# EAGLE design Interface (EAGLE 7.6.0)

## Sheet 1 of 2
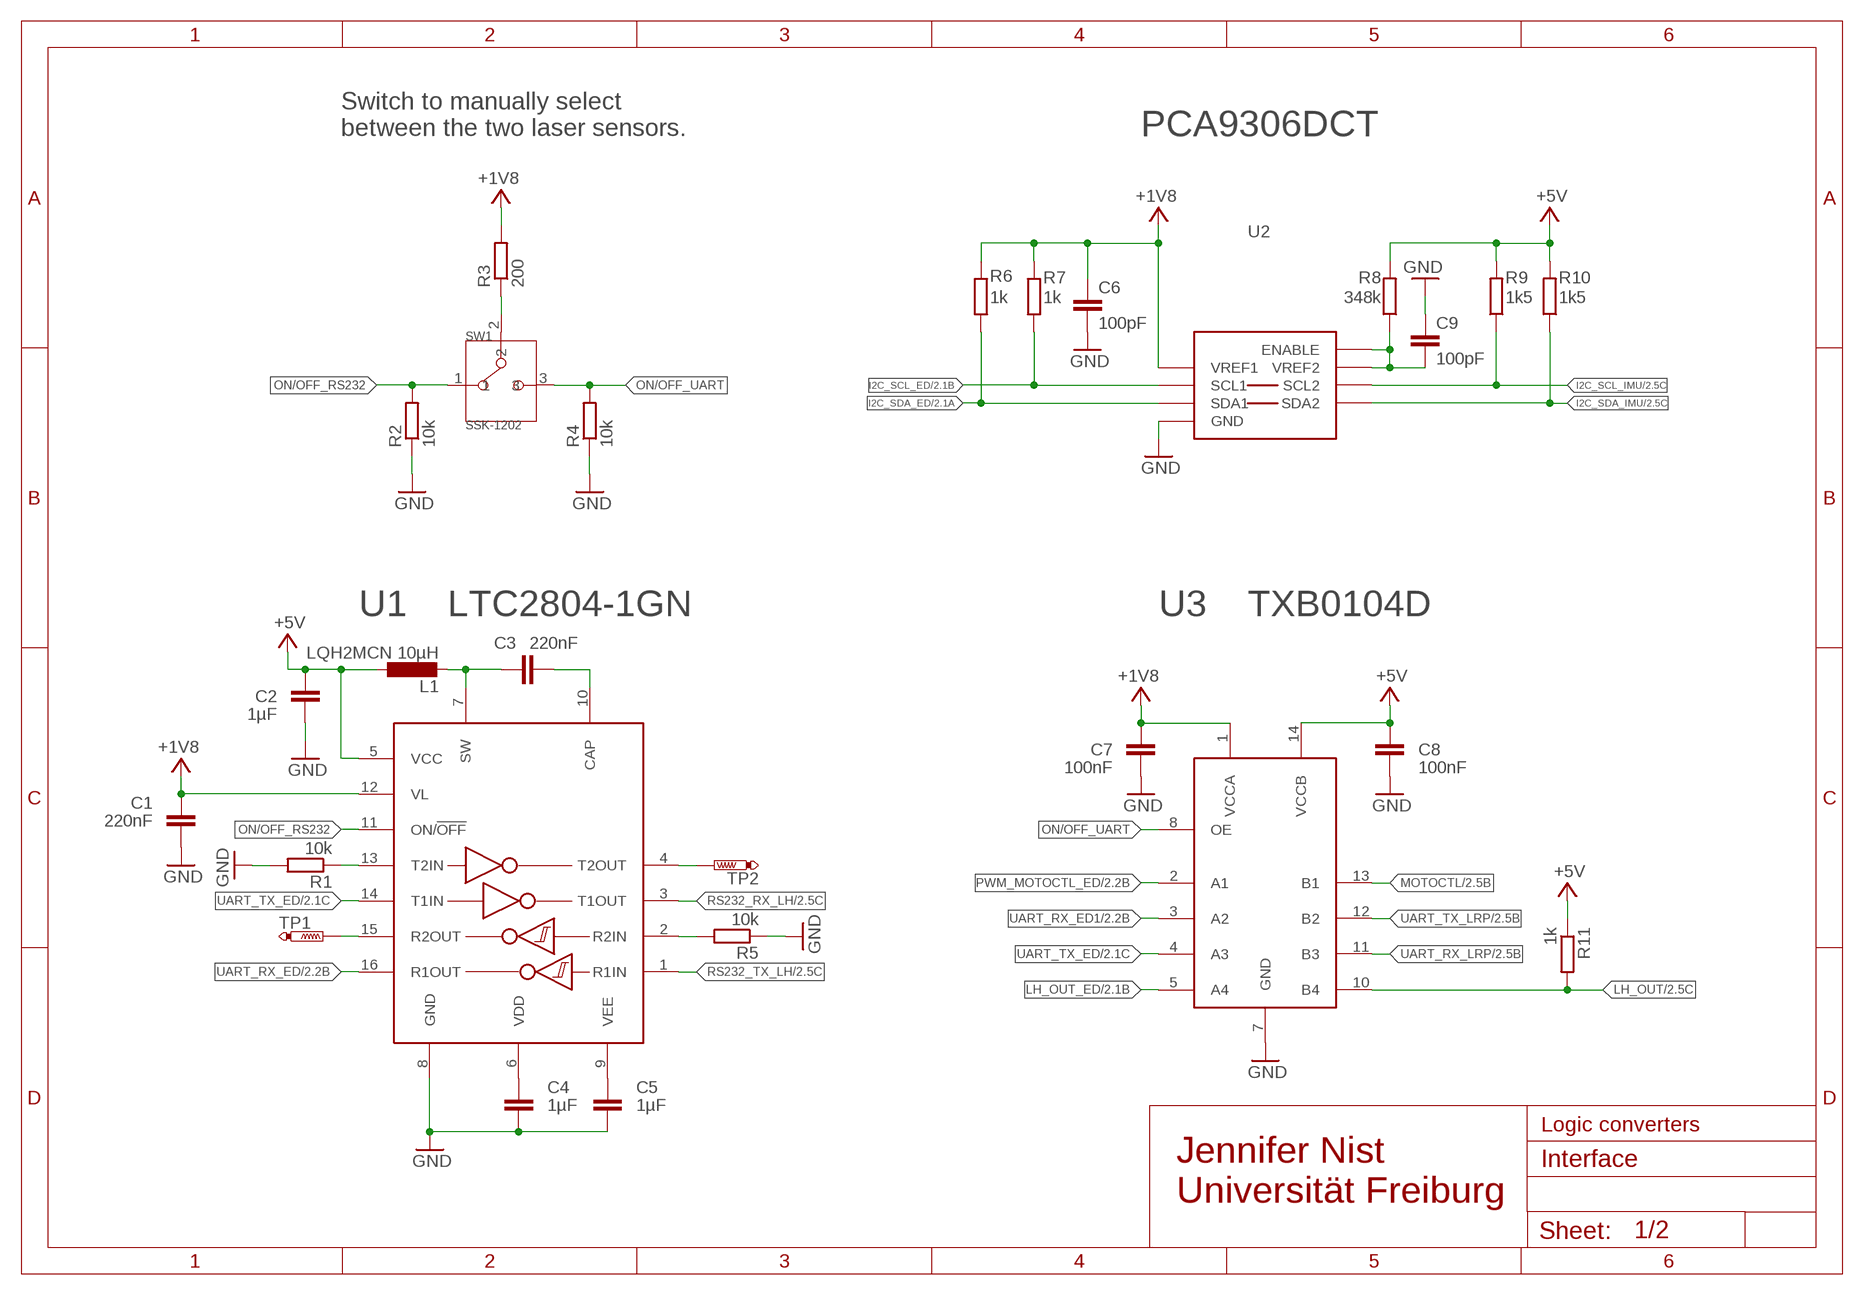
[diagram p0: schematic, sheet 1]

### Parts
C1  220nF  C-EUC0805K  [C0805K]
C2  1µF  C-EUC0805K  [C0805K]
C3  220nF  C-EUC0805K  [C0805K]
C4  1µF  C-EUC0805K  [C0805K]
C5  1µF  C-EUC0805K  [C0805K]
C6  100pF  C-EUC0805K  [C0805K]
C7  100nF  C-EUC0805K  [C0805K]
C8  100nF  C-EUC0805K  [C0805K]
C9  100pF  C-EUC0805K  [C0805K]
L1  LQH2MCN 10µH  LQH2MCN  [L0806]
R1  10k  R-EU_R0805  [R0805]
R2  10k  R-EU_R0805  [R0805]
R3  200  R-EU_R0805  [R0805]
R4  10k  R-EU_R0805  [R0805]
R5  10k  R-EU_R0805  [R0805]
R6  1k  R-EU_R1206  [R1206]
R7  1k  R-EU_R1206  [R1206]
R8  348k  R-EU_R0805  [R0805]
R9  1k5  R-EU_R1206  [R1206]
R10  1k5  R-EU_R1206  [R1206]
R11  1k  R-EU_R0805  [R0805]
SW1  SSK-1202  [SSK-1202]
TP1  PTR1B1,27  [B1,27]
TP2  PTR1B1,27  [B1,27]
U1  LTC2804-1GN  [SSOP-16]
U2  PCA9306DCT  [SSOP-8]
U3  TXB0104D  [SOIC-14]

### Nets
+1V8: C1.2 C6.2 C7.1 R3.2 R6.1 R7.1 U1.12(VL) U2.2(VREF1) U3.1(VCCA) ; also sheet 2
+5V: C2.2 C8.1 L1.1 R8.2 R9.2 R10.2 R11.1 U1.5(VCC) U3.14(VCCB) ; also sheet 2
GND: C1.1 C2.1 C4.2 C5.2 C6.1 C7.2 C8.2 C9.2 R1.2 R2.1 R4.1 R5.1 U1.8(GND) U2.1(GND) U3.7(GND) ; also sheet 2
I2C_SCL_ED: R7.2 U2.3(SCL1) ; also sheet 2
I2C_SCL_IMU: R9.1 U2.6(SCL2) ; also sheet 2
I2C_SDA_ED: R6.2 U2.4(SDA1) ; also sheet 2
I2C_SDA_IMU: R10.1 U2.5(SDA2) ; also sheet 2
LH_OUT: R11.2 U3.10(B4) ; also sheet 2
LH_OUT_ED: U3.5(A4) ; also sheet 2
MOTOCTL: U3.13(B1) ; also sheet 2
N$3: R3.1 SW1.2
N$5: C3.1 L1.2 U1.7(SW)
N$6: C9.1 R8.1 U2.7(VREF2) U2.8(ENABLE)
N$7: C3.2 U1.10(CAP)
N$8: R1.1 U1.13(T2IN)
N$10: R5.2 U1.2(R2IN)
N$11: TP2.TP U1.4(T2OUT)
N$12: TP1.TP U1.15(R2OUT)
ON/OFF_RS232: R2.2 SW1.1 U1.11(ON/!OFF)
ON/OFF_UART: R4.2 SW1.3 U3.8(OE)
PWM_MOTOCTL_ED: U3.2(A1) ; also sheet 2
RS232_RX_LH: U1.3(T1OUT) ; also sheet 2
RS232_TX_LH: U1.1(R1IN) ; also sheet 2
UART_RX_ED: U1.16(R1OUT) ; also sheet 2
UART_RX_ED1: U3.3(A2) ; also sheet 2
UART_RX_LRP: U3.11(B3) ; also sheet 2
UART_TX_ED: U1.14(T1IN) U3.4(A3) ; also sheet 2
UART_TX_LRP: U3.12(B2) ; also sheet 2
VDD: C4.1 U1.6(VDD)
VEE: C5.1 U1.9(VEE)

### Notes on the sheet
- Switch to manually select 
  between the two laser sensors.
- Logic converters
- Jennifer Nist
  Universität Freiburg

## Sheet 2 of 2
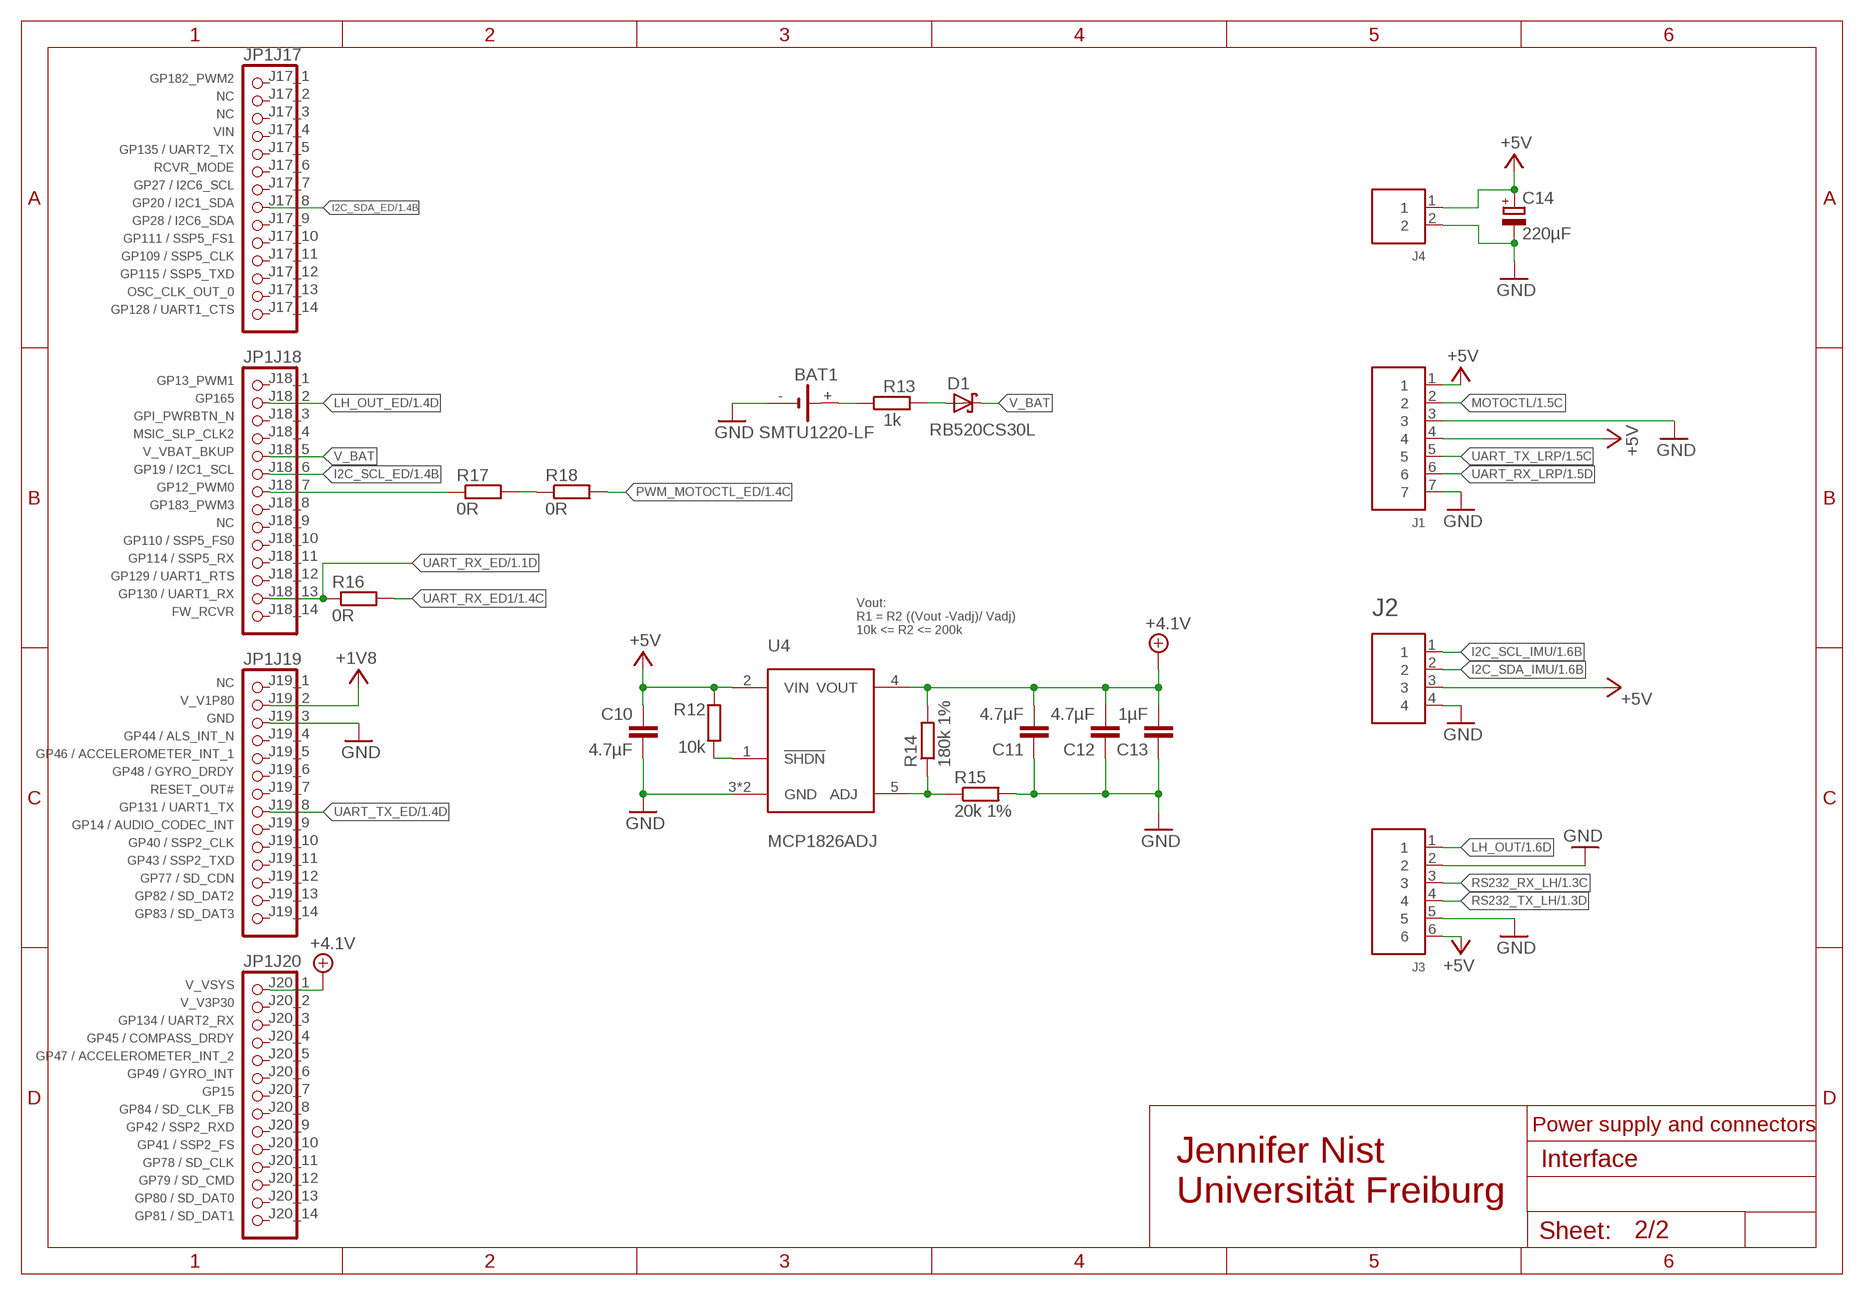
[diagram p1: schematic, sheet 2]

### Parts
BAT1  SMTU1220-LF  [SMTU1220-LF]
C10  4.7µF  C-EUC0805K  [C0805K]
C11  4.7µF  C-EUC0805K  [C0805K]
C12  4.7µF  C-EUC0805K  [C0805K]
C13  1µF  C-EUC0805K  [C0805K]
C14  220µF  CPOL-EUE3.5-8  [E3,5-8]
D1  RB520CS30L  [SOD882]
J1  S7B-XH-A90°  [S7B-XH-A]
J2  S4B-XH-A90°  [S4B-XH-A]
J3  S6B-XH-A90°  [S6B-XH-A]
J4  S2B-XH-A90°  [S2B-XH-A]
JP1  edison  INTEL_EDISON_BB_HEADER  [1X14]
R12  10k  R-EU_R0805  [R0805]
R13  1k  R-EU_R0805  [R0805]
R14  180k 1%  R-EU_R0805  [R0805]
R15  20k 1%  R-EU_R0805  [R0805]
R16  0R  R-EU_R1206  [R1206]
R17  0R  R-EU_R1206  [R1206]
R18  0R  R-EU_R1206  [R1206]
U4  MCP1826ADJ  [SOT-223-5]

### Nets
+1V8: JP1.J19_2 ; also sheet 1
+4.1V: C11.2 C12.2 C13.2 JP1.J20_1 R14.2 U4.4(VOUT)
+5V: C10.1 C14.+ J1.1 J1.4 J2.3 J3.6 J4.1 R12.2 U4.2(VIN) ; also sheet 1
GND: BAT1.- C10.2 C11.1 C12.1 C13.1 C14.- J1.3 J1.7 J2.4 J3.2 J3.5 J4.2 JP1.J19_3 R15.2 U4.3(GND) U4.TAB(GND) ; also sheet 1
I2C_SCL_ED: JP1.J18_6 ; also sheet 1
I2C_SCL_IMU: J2.1 ; also sheet 1
I2C_SDA_ED: JP1.J17_8 ; also sheet 1
I2C_SDA_IMU: J2.2 ; also sheet 1
LH_OUT: J3.1 ; also sheet 1
LH_OUT_ED: JP1.J18_2 ; also sheet 1
MOTOCTL: J1.2 ; also sheet 1
N$1: BAT1.+ R13.1
N$2: R12.1 U4.1(!SHDN)
N$4: R14.1 R15.1 U4.5(ADJ)
N$9: D1.A R13.2
N$13: JP1.J18_7 R17.1
N$14: R17.2 R18.1
PWM_MOTOCTL_ED: R18.2 ; also sheet 1
RS232_RX_LH: J3.3 ; also sheet 1
RS232_TX_LH: J3.4 ; also sheet 1
UART_RX_ED: JP1.J18_13 R16.1 ; also sheet 1
UART_RX_ED1: R16.2 ; also sheet 1
UART_RX_LRP: J1.6 ; also sheet 1
UART_TX_ED: JP1.J19_8 ; also sheet 1
UART_TX_LRP: J1.5 ; also sheet 1
V_BAT: D1.C JP1.J18_5
Unconnected: JP1.J17_1 JP1.J17_2 JP1.J17_3 JP1.J17_4 JP1.J17_5 JP1.J17_6 JP1.J17_7 JP1.J17_9 JP1.J17_10 JP1.J17_11 JP1.J17_12 JP1.J17_13 JP1.J17_14 JP1.J18_1 JP1.J18_3 JP1.J18_4 JP1.J18_8 JP1.J18_9 JP1.J18_10 JP1.J18_11 JP1.J18_12 JP1.J18_14 JP1.J19_1 JP1.J19_4 JP1.J19_5 JP1.J19_6 JP1.J19_7 JP1.J19_9 JP1.J19_10 JP1.J19_11 JP1.J19_12 JP1.J19_13 JP1.J19_14 JP1.J20_2 JP1.J20_3 JP1.J20_4 JP1.J20_5 JP1.J20_6 JP1.J20_7 JP1.J20_8 JP1.J20_9 JP1.J20_10 JP1.J20_11 JP1.J20_12 JP1.J20_13 JP1.J20_14

### Notes on the sheet
- Vout:
  R1 = R2 ((Vout -Vadj)/ Vadj)
  10k <= R2 <= 200k
- Power supply and connectors
- Jennifer Nist
  Universität Freiburg

## Library data of the parts
BAT1 = wearloc:SMTU1220-LF: renata batteries battery holder for 1220 batteries Data Sheet <http://www.produktinfo.conrad.com/datenblaetter/1000000-1099999/001009391-da-01-en-RENATA_KNOPFZELLENHALTERUNG_SMTU1220_LF.pdf>
C1-C13 = rcl:C-EU: CAPACITOR, European symbol
C14 = rcl:CPOL-EU: POLARIZED CAPACITOR, European symbol
D1 = wearloc:RB520CS30L: NXP Semiconductors schottky diode Data Sheet <http://www.produktinfo.conrad.com/datenblaetter/1100000-1199999/001111624-da-01-en-DIODE_SCHOTTK_RB520CS30L_315_SOD_882_NXP.pdf>
J1 = wearloc:S7B-XH-A: Wire-to-Board 2.5mm pitch side mount connector Source: http://www.jst-mfg.com/product/pdf/eng/eXH.pdf http://www.jst-mfg.com/product/detail_e.php?series=277
J2 = wearloc:S4B-XH-A: Wire-to-Board 2.5mm pitch side mount connector Source: http://www.jst-mfg.com/product/pdf/eng/eXH.pdf http://www.jst-mfg.com/product/detail_e.php?series=277
J3 = wearloc:S6B-XH-A: Wire-to-Board 2.5mm pitch side mount connector Source: http://www.jst-mfg.com/product/pdf/eng/eXH.pdf http://www.jst-mfg.com/product/detail_e.php?series=277
J4 = wearloc:S2B-XH-A: Wire-to-Board 2.5mm pitch side mount connector Source: http://www.jst-mfg.com/product/pdf/eng/eXH.pdf http://www.jst-mfg.com/product/detail_e.php?series=277
JP1 = wearloc:INTEL_EDISON_BB_HEADER: PIN HEADER
L1 = wearloc:LQH2MC: muRata chip inductor Wire Wound Type with Ferrite Core 1.0–82μH/90–595mA Data Sheet <http://psearch.en.murata.com/inductor/product/LQH2MCN100K02%23.pdf> Product cataloge <http://www.murata.com/~/media/webrenewal/support/library/catalog/products/inductor/chip/o05e.ashx>
R1-R18 = rcl:R-EU_: RESISTOR, European symbol
SW1 = wearloc:SSK-1202: SSK three way slide switch Data Sheet <http://www.produktinfo.conrad.com/datenblaetter/700000-724999/709774-da-01-en-SCHIEBESCHALTER_SMD_SSK1202.pdf>
TP1 TP2 = testpad:PTR1: TEST PIN
U1 = wearloc:LTC2804-1: Linear Technology Dual RS-232 Transceiver Supply range of 1.8V to 5.5V Data Sheet <http://cds.linear.com/docs/en/datasheet/2801234fe.pdf>
U2 = wearloc:PCA9306: Texas Instruments PCA9306 I2C Level shifter from 1.2 V to 5.5V Data Sheet <http://www.ti.com/lit/ds/symlink/pca9306.pdf>
U3 = wearloc:TXB0104: Texas Instuments 4-Bit Bidirectional Voltagelevel Translator 1.2V - 3.6V at port A and 1.65V - 5.5V at port B, with VCC1 ≤ VCCB Data Sheet <http://www.ti.com/lit/ds/symlink/txb0104.pdf>
U4 = wearloc:MCP1826: Microchip MCP1826 1000 mA, Low-Voltage, Low Quiescent Current LDO Regulator Low Dropout Voltage: 250 mV Typical at 1000 mA Data Sheet <http://ww1.microchip.com/downloads/en/DeviceDoc/22057B.pdf>

## Board
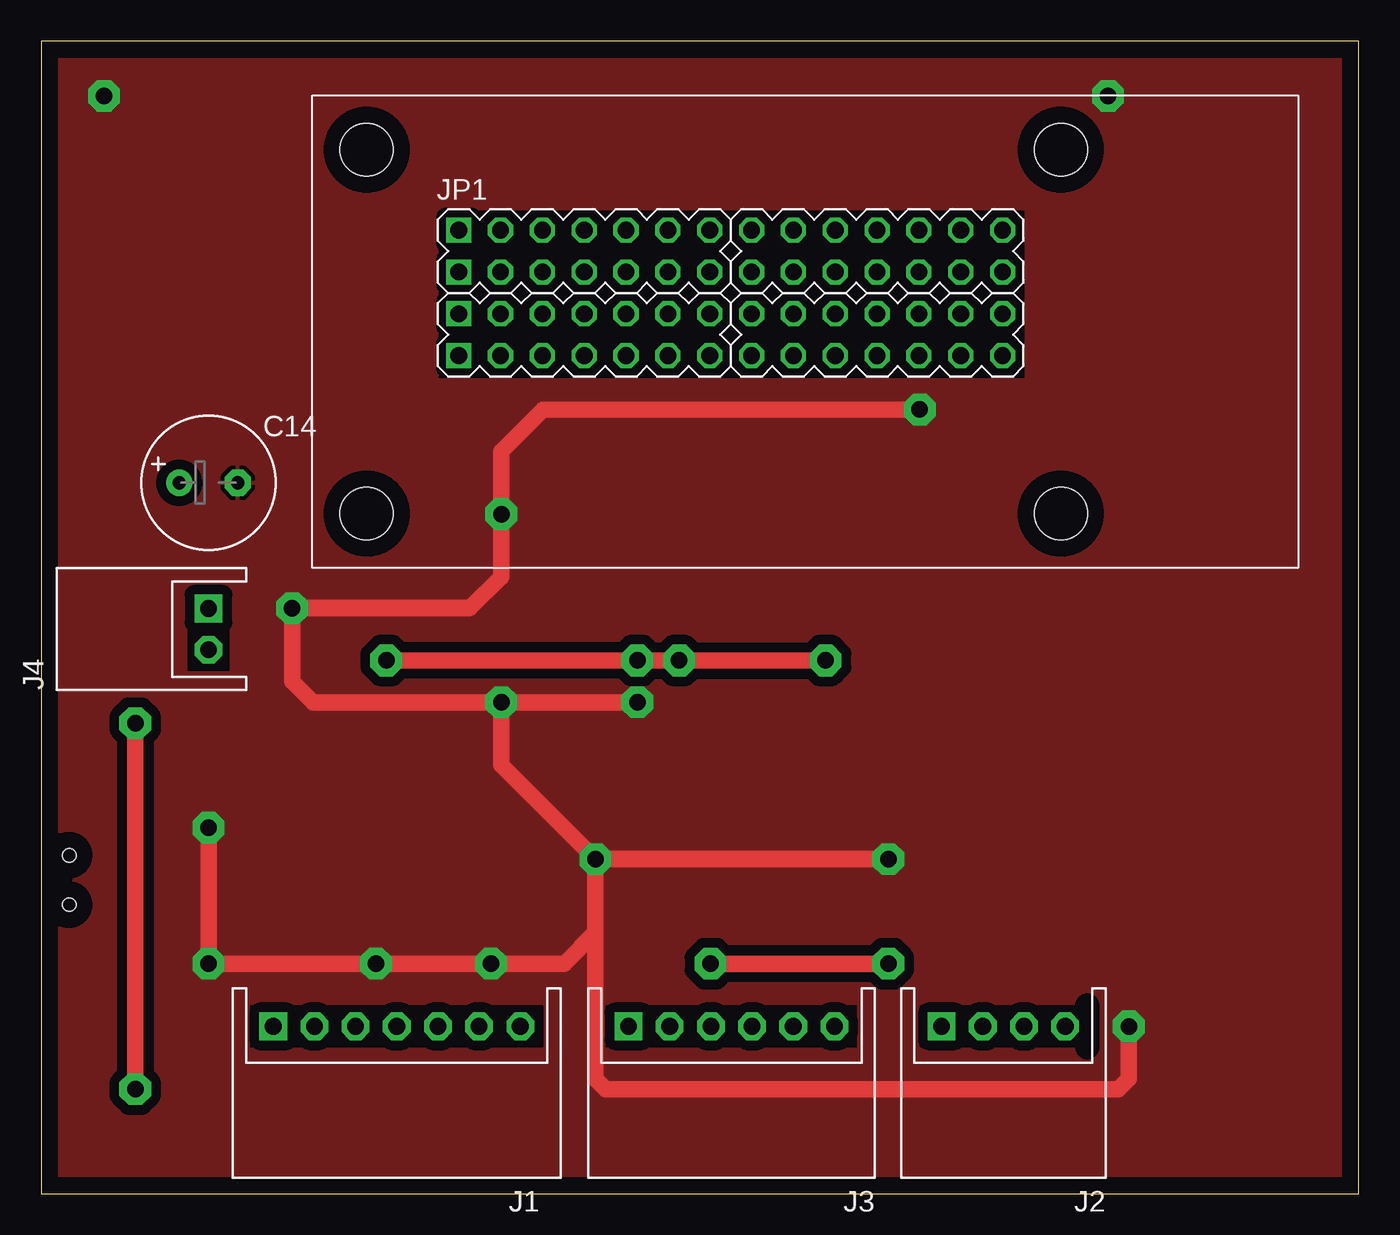
[diagram p2: board, top side]
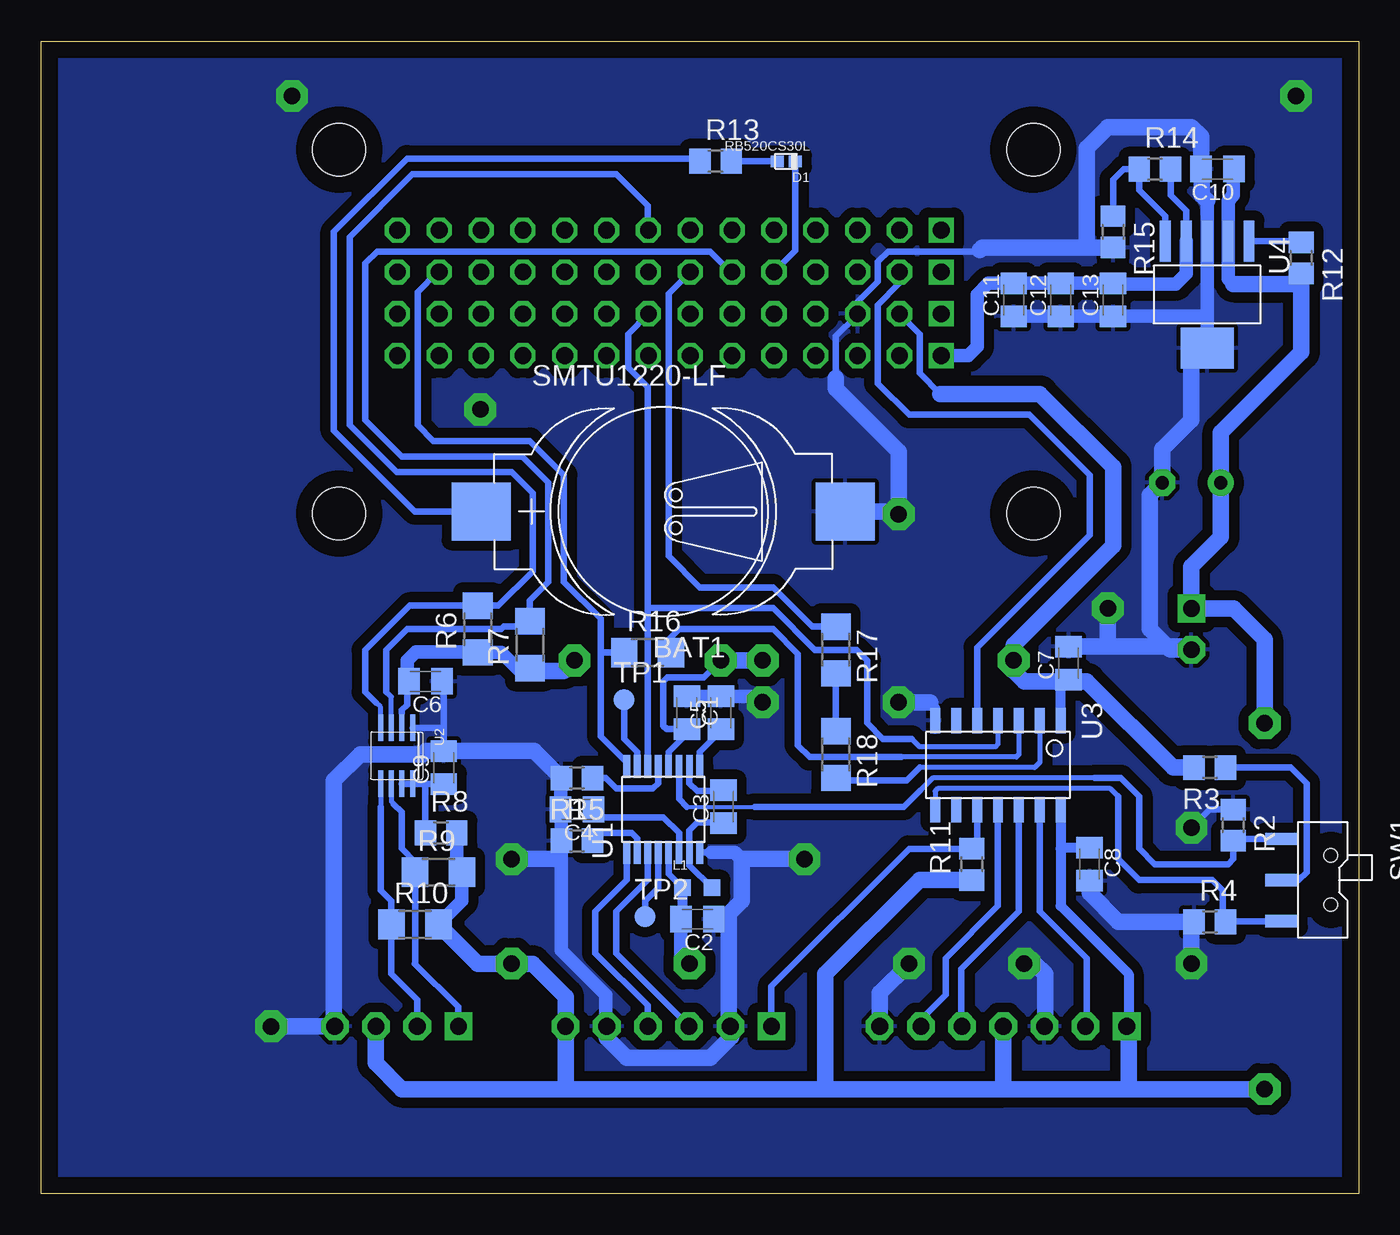
[diagram p3: board, bottom side, seen from below]

Size 80 x 70 mm. Coordinates in mm from the lower left corner, seen from the top.
Outline: 0,0 80,0 80,70 0,70 0,0
Copper layers (1*16): Top 0.035mm / dielectric 1.5mm / Bottom 0.035mm
Design rules "home-etch": minimum track width 10mil, minimum drill 0.3mm, track to track 10mil, track to pad 10mil, pad to pad 10mil, via to via 10mil, smd to smd 10mil, copper to edge 40mil, drill to drill 10mil, minimum pad ring 10mil, minimum via ring 10mil, stop-mask expansion 4mil, vias tented up to drill 0mil, thermal gap 10mil
tRestrict: area 63.5,8.9 to 63.5,11.4

### Footprints (pad centres in the part's own frame; a part is rotated, then mirrored left to right if it is on the bottom)
SMTU1220-LF = smd 3.5 x 3.6: + 0,11.05; - 0,-11.05
C0805K = smd 1.3 x 1.6: 1 -1,0; 2 1,0
E3,5-8 = drill 0.813 pad 1.6: + -1.778,0 | drill 0.813 pad 1.6 octagon: - 1.778,0
SOD882 = smd 0.8 x 0.7: A 0.55,0; C -0.55,0
S7B-XH-A = drill 1.016 pad 1.676 square: 1 7.5,0 | drill 1.016 pad 1.676 octagon: 2 5,0; 3 2.5,0; 4 0,0; 5 -2.5,0; 6 -5,0; 7 -7.5,0
S4B-XH-A = drill 1.016 pad 1.676 square: 1 3.75,0 | drill 1.016 pad 1.676 octagon: 2 1.25,0; 3 -1.25,0; 4 -3.75,0
S6B-XH-A = drill 1.016 pad 1.676 square: 1 6.25,0 | drill 1.016 pad 1.676 octagon: 2 3.75,0; 3 1.25,0; 4 -1.25,0; 5 -3.75,0; 6 -6.25,0
S2B-XH-A = drill 1.016 pad 1.676 square: 1 1.25,0 | drill 1.016 pad 1.676 octagon: 2 -1.25,0
1X14 = drill 1.016 square: J17_1 -16.51,3.81; J18_1 -16.51,1.27; J19_1 -16.51,-1.27; J20_1 -16.51,-3.81 | drill 1.016 octagon: J17_2 -13.97,3.81; J17_3 -11.43,3.81; J17_4 -8.89,3.81; J17_5 -6.35,3.81; J17_6 -3.81,3.81; J17_7 -1.27,3.81; J17_8 1.27,3.81; J17_9 3.81,3.81; J17_10 6.35,3.81; J17_11 8.89,3.81; J17_12 11.43,3.81; J17_13 13.97,3.81; J17_14 16.51,3.81; J18_2 -13.97,1.27; J18_3 -11.43,1.27; J18_4 -8.89,1.27; J18_5 -6.35,1.27; J18_6 -3.81,1.27; J18_7 -1.27,1.27; J18_8 1.27,1.27; J18_9 3.81,1.27; J18_10 6.35,1.27; J18_11 8.89,1.27; J18_12 11.43,1.27; J18_13 13.97,1.27; J18_14 16.51,1.27; J19_2 -13.97,-1.27; J19_3 -11.43,-1.27; J19_4 -8.89,-1.27; J19_5 -6.35,-1.27; J19_6 -3.81,-1.27; J19_7 -1.27,-1.27; J19_8 1.27,-1.27; J19_9 3.81,-1.27; J19_10 6.35,-1.27; J19_11 8.89,-1.27; J19_12 11.43,-1.27; J19_13 13.97,-1.27; J19_14 16.51,-1.27; J20_2 -13.97,-3.81; J20_3 -11.43,-3.81; J20_4 -8.89,-3.81; J20_5 -6.35,-3.81; J20_6 -3.81,-3.81; J20_7 -1.27,-3.81; J20_8 1.27,-3.81; J20_9 3.81,-3.81; J20_10 6.35,-3.81; J20_11 8.89,-3.81; J20_12 11.43,-3.81; J20_13 13.97,-3.81; J20_14 16.51,-3.81 | hole 3.2: -22.1,8.7; -22.1,-13.4; 20.05,-13.4; 20.05,8.7
L0806 = smd 1 x 1: 1 -0.9,0; 2 0.9,0
R0805 = smd 1.3 x 1.5: 1 -0.95,0; 2 0.95,0
R1206 = smd 1.6 x 1.803: 1 -1.422,0; 2 1.422,0
SSK-1202 = smd 0.75 x 2: 1 -2.5,-0.25; 2 0,-0.25; 3 2.5,-0.25 | hole 0.8: -1.5,2.75; 1.5,2.75
B1,27 = smd 1.27 x 1.27: TP 0,0
SSOP-16 = smd 1.397 x 0.419: 1 -2.603,2.223; 2 -2.603,1.587; 3 -2.603,0.953; 4 -2.603,0.318; 5 -2.603,-0.318; 6 -2.603,-0.953; 7 -2.603,-1.587; 8 -2.603,-2.223; 9 2.603,-2.223; 10 2.603,-1.587; 11 2.603,-0.953; 12 2.603,-0.318; 13 2.603,0.318; 14 2.603,0.953; 15 2.603,1.587; 16 2.603,2.223
SSOP-8 = smd 1.6 x 0.3: 1 -1.625,0.975; 2 -1.625,0.325; 3 -1.625,-0.325; 4 -1.625,-0.975; 5 1.775,-0.975; 6 1.775,-0.325; 7 1.775,0.325; 8 1.775,0.975
SOIC-14 = smd 1.55 x 0.6: 1 -2.7,3.81; 2 -2.7,2.54; 3 -2.7,1.27; 4 -2.7,0; 5 -2.7,-1.27; 6 -2.7,-2.54; 7 -2.7,-3.81; 8 2.7,-3.81; 9 2.7,-2.54; 10 2.7,-1.27; 11 2.7,0; 12 2.7,1.27; 13 2.7,2.54; 14 2.7,3.81
SOT-223-5 = smd 0.65 x 2.5: 1 -2.54,-3.25; 2 -1.27,-3.25; 3 0,-3.25; 4 1.27,-3.25; 5 2.54,-3.25 | smd 3.2 x 2.5: TAB 0,3.25

### Placement (x,y rotation side)
BAT1  42.23,41.43 90 bottom
C1  40.8,29.21 270 bottom
C2  40.16,16.67 180 bottom
C3  38.58,23.5 90 bottom
C4  47.47,23.34 180 bottom
C5  38.73,29.21 90 bottom
C6  56.67,31.11 180 bottom
C7  17.62,32.23 90 bottom
C8  16.35,20 270 bottom
C9  55.56,25.88 90 bottom
C10  8.57,62.23 180 bottom
C11  20.95,54.29 90 bottom
C12  18.1,54.29 90 bottom
C13  14.92,54.29 90 bottom
C14  10.16,43.18 0 top
D1  34.77,62.71 180 bottom
J1  21.59,10.16 180 top
J2  58.42,10.16 180 top
J3  41.91,10.16 180 top
J4  10.16,34.29 90 top
JP1  41.86,54.71 0 top
L1  40.16,18.57 0 bottom
R1  47.47,25.24 180 bottom
R2  7.62,22.38 270 bottom
R3  9.05,25.88 180 bottom
R4  9.05,16.51 0 bottom
R5  47.47,21.43 0 bottom
R6  53.5,34.29 90 bottom
R7  50.32,33.34 90 bottom
R8  55.72,21.91 0 bottom
R9  55.88,19.53 0 bottom
R10  57.31,16.35 0 bottom
R11  23.5,20 90 bottom
R12  3.49,56.83 270 bottom
R13  39.05,62.71 0 bottom
R14  12.38,62.23 0 bottom
R15  14.92,58.42 270 bottom
R16  43.18,32.86 0 bottom
R17  31.75,33.02 270 bottom
R18  31.75,26.67 270 bottom
SW1  4.45,19.05 270 bottom
TP1  44.61,30 0 bottom
TP2  43.34,16.83 0 bottom
U1  42.23,23.34 90 bottom
U2  58.42,26.67 270 bottom
U3  21.91,26.04 270 bottom
U4  9.21,54.61 180 bottom

### Tracks (layer width: path | path; a pad name or v marks a point on that pad's centre or on a via)
+1V8  (via drill 1 pad 1.93)
  Top 1.016: v20.95,32.38 v36.2,32.38 v38.73,32.38 v47.62,32.38
  Bottom 0.305: U2.2 58.09,29.2 58.1,29.21
  Bottom 0.406: U1.12 41.91,26.83 41.12,27.62 41.12,27.89 C1.2 42.02,28.21 42.23,28.42 42.23,31.11 41.99,31.35 39.77,31.35 v38.73,32.38 | 58.1,29.21 58.1,29.37 57.78,29.69 57.78,31 C6.2 | JP1.J19_2 26.67,52.22 26.67,49.85 25.4,48.58 | R7.1 50.49,31.75
  Bottom 0.61: U3.1 18.1,30.75 C7.1
  Bottom 0.813: 50.49,31.75 50.96,31.75 52.08,32.87 R6.1 53.54,32.91 57.26,32.91 57.78,32.38 57.78,31.23 C6.2
  Bottom 1.016: R3.2 11.27,25.88 16.51,31.11 17.51,31.11 C7.1 17.73,31.11 20.32,31.11 20.95,31.75 v20.95,32.38 20.95,33.34 14.92,39.37 14.92,44.13 19.37,48.58 25.4,48.58 | v47.62,32.38 48.26,31.75 50.16,31.75 R7.1 | v36.2,32.38 v38.73,32.38
+4.1V
  Bottom 0.406: U4.4 10.48,59.69 11.43,60.64 R14.2
  Bottom 0.813: U4.4 10.48,55.88 11.11,55.24 14.88,55.24 C13.2 C12.2 C11.2 22.5,55.29 23.18,54.61 23.18,51.44 23.71,50.9 JP1.J20_1
+5V  (via drill 1 pad 1.93)
  Top 1.016: v51.44,13.97 v40.64,13.97 | v5.71,28.57 v5.71,6.35
  Bottom 0.406: U1.5 41.91,19.42 L1.1
  Bottom 0.61: L1.1 41.06,16.77 C2.2 | U3.14 18.1,20.95 | 18.1,20.95 18.1,17.46 13.97,13.34 13.97,10.28 J1.1 | C8.1 18.05,21 18.1,20.95
  Bottom 0.813: C10.1 7.62,61.55 7.62,60.64 7.94,60.33 U4.2 7.94,55.56 7.62,55.24 | R8.2 54.77,19.84 R9.2 54.46,17.78 R10.2 | C2.2 41.16,14.49 v40.64,13.97
  Bottom 1.016: R12.2 3.49,55.24 | 3.49,55.24 3.49,51.12 8.38,46.23 C14.+ 8.38,39.88 10.16,38.1 J4.1 7.6,35.54 5.71,33.66 v5.71,28.57 | 7.62,55.24 3.49,55.24 | R11.1 26.67,19.05 32.38,13.34 32.38,6.35 | 13.97,6.35 13.97,10.04 J1.1 | J1.4 21.59,6.35 | J2.3 59.69,10.14 59.69,7.94 58.1,6.35 47.94,6.35 | R10.2 53.51,13.97 v51.44,13.97 50.16,13.97 48.16,11.96 J3.6 48.16,6.57 47.94,6.35 | 47.94,6.35 32.38,6.35 | 32.38,6.35 21.59,6.35 | v5.71,6.35 13.97,6.35 | 13.97,6.35 21.59,6.35
GND  (via drill 1 pad 1.93)
  Top 1.016: v10.16,22.23 v10.16,13.97 v20.32,13.97 v27.3,13.97 31.75,13.97 33.66,15.88 | 33.66,15.88 v33.66,20.32 | 33.66,15.88 33.66,6.99 34.29,6.35 65.41,6.35 66.04,6.99 v66.04,10.16 | v27.94,29.84 27.94,26.04 v33.66,20.32 | v27.94,29.84 16.51,29.84 15.24,31.11 v15.24,35.56 26.04,35.56 27.94,37.47 v27.94,41.27 27.94,45.09 30.48,47.62 v53.34,47.62 | v27.94,29.84 v36.2,29.84 | v33.66,20.32 v51.44,20.32
  Bottom 0.406: JP1.J19_3 30.43,54.18 29.21,55.4 29.21,56.59 28.57,57.23 23.1,57.23 23.02,57.31 | 15.08,57.31 R15.2 | U1.8 39.31,20.73 | C9.2 55.56,28.42 | 55.56,28.42 55.56,31 C6.1 | U2.1 55.68,28.3 55.56,28.42 | R2.1 9.05,23.33 v10.16,22.23 | 31.75,49.53 31.75,52.07 30.48,53.34
  Bottom 0.61: 38.26,16.67 C2.1 | U3.7 25.72,29.53 26.04,29.84
  Bottom 0.813: 9.21,60.33 U4.3 9.21,53.02 | 9.21,53.02 U4.TAB | R15.2 | 9.21,53.02 9.48,53.29 C13.1 C12.1 C11.1 | C1.1 39.37,30.21 | 39.37,30.21 C5.2 36.56,30.21 v36.2,29.84 | 39.37,30.21 | R1.2 48.47,25.19 C4.2 48.42,23.29 R5.1 48.42,14.76 45.72,12.06 45.72,10.22 J3.5 | 38.26,10.26 J3.2 | 39.31,20.73 37.88,20.73 37.47,20.32
  Bottom 1.016: U4.TAB 10.16,50.41 10.16,46.99 11.94,45.21 C14.- 12.7,42.42 12.7,34.29 11.45,33.04 J4.2 10.35,33.23 15.24,33.23 | R15.2 16.51,57.47 | 9.21,60.33 9.53,60.64 9.53,61.55 9.57,61.59 C10.2 9.57,64.18 10.16,64.77 15.24,64.77 16.51,63.5 16.51,57.47 | 16.51,57.47 22.86,57.47 23.02,57.31 | R1.2 50.05,26.88 C9.2 56.63,26.88 56.83,26.67 60.64,26.67 62.23,25.08 62.23,10.22 J2.4 v66.04,10.16 | J3.5 45.66,9.46 44.45,8.26 39.37,8.26 38.1,9.53 38.1,10.1 J3.2 | C7.2 15.24,33.23 | C8.2 16.35,18.26 14.61,16.51 R4.1 10.16,16.35 v10.16,13.97 | v20.32,13.97 19.68,13.97 19.05,13.34 19.05,10.2 J1.3 | J1.7 29.09,12.19 v27.3,13.97 | 38.26,10.26 38.26,16.67 38.26,16.99 37.47,17.78 37.47,20.32 v33.66,20.32 | 26.04,29.84 v27.94,29.84 | v15.24,35.56 15.24,33.23 | BAT1.- 28.1,41.43 v27.94,41.27 27.94,45.09 31.75,48.9 31.75,49.53 | v51.44,20.32 49.53,20.32 48.9,20.32
  other vias: 3.81,66.67 64.77,66.67
  pour Top (isolate 0.61, rank 2): 0,69.85 80.01,69.85 80.01,0 0,0
  pour Bottom (isolate 0.61, rank 2): 0,69.85 80.01,69.85 80.01,0 0,0
I2C_SCL_ED
  Bottom 0.305: U2.3 58.74,30.17 59.05,30.48
  Bottom 0.406: 59.05,30.48 59.05,33.02 57.78,34.29 52.07,34.29 51.91,34.45 50.63,34.45 R7.2 50.32,36.04 49.21,37.15 49.21,43.18 50.8,44.77 58.1,44.77 60.33,46.99 60.33,56.52 59.61,57.23 39.37,57.23 38.12,55.98 JP1.J18_6
I2C_SCL_IMU
  Bottom 0.305: U2.6 58.74,23.82 58.58,23.65
  Bottom 0.406: 58.58,23.65 58.1,23.18 58.1,20.95 57.31,20.16 R9.1 57.3,13.98 57.31,13.97 54.67,11.33 J2.1
I2C_SDA_ED
  Bottom 0.305: U2.4 59.4,29.55 59.69,29.84
  Bottom 0.406: 53.66,35.88 R6.2 | R6.2 52.24,35.71 50.16,37.78 50.16,42.55 51.44,43.81 58.42,43.81 61.28,46.67 61.28,58.1 57.47,61.91 45.09,61.91 43.18,60.01 43.18,58.57 JP1.J17_8 | R6.2 57.63,35.71 60.33,33.02 60.33,30.48 59.69,29.84
I2C_SDA_IMU
  Bottom 0.305: U2.5 59.4,23.52 59.37,23.5
  Bottom 0.406: 59.37,23.5 59.37,18.41 58.74,17.78 R10.1 | R10.1 | R10.1 58.74,13.34 57.17,11.77 J2.2
LH_OUT
  Bottom 0.406: U3.10 23.18,21.27 R11.2 27.31,20.95 35.66,12.6 J3.1
LH_OUT_ED
  Bottom 0.406: JP1.J18_2 27.89,55.3 29.21,53.98 29.21,49.21 27.3,47.31 20,47.31 16.35,43.66 16.35,40.01 23.18,33.18 U3.5
MOTOCTL
  Bottom 0.406: U3.13 19.37,17.14 16.51,14.29 16.51,10.24 J1.2
N$1
  Bottom 0.406: R13.1 40.16,62.87 57.78,62.87 62.23,58.42 62.23,46.35 57.31,41.43 BAT1.+
N$2
  Bottom 0.406: U4.1 4.21,57.86 R12.1
N$3
  Bottom 0.406: R3.1 4.13,25.88 3.17,24.92 3.17,19.53 3.65,19.05 SW1.2
N$4
  Bottom 0.406: U4.5 11.75,59.37 13.34,60.96 R14.1 14.29,62.23 14.92,61.59 R15.1
N$5
  Bottom 0.406: C3.1 38.62,22.54 40.16,22.54 40.64,22.07 U1.7 40.64,19.95 L1.2 39.37,18.68
N$6
  Bottom 0.406: U2.7 U2.8 56.83,24.89 | 56.83,24.89 55.58,24.89 C9.1 | R8.1 56.67,24.73 56.83,24.89
N$7
  Bottom 0.406: U1.10 40.64,24.92 40.16,24.45 38.62,24.45 C3.2
N$8
  Bottom 0.406: U1.13 42.55,24.92 42.86,24.61 45.09,24.61 45.72,25.24 R1.1
N$9
  Bottom 0.406: D1.A R13.2
N$10
  Bottom 0.406: U1.2 43.81,21.59 44.13,21.91 46.04,21.91 R5.2
N$11
  Bottom 0.406: U1.4 42.55,18.57 43.34,17.78 TP2.TP
N$12
  Bottom 0.406: U1.15 43.81,26.83 44.61,27.62 TP1.TP
N$13
  Bottom 0.406: JP1.J18_7 41.91,54.66 41.91,38.73 40.01,36.83 35.56,36.83 33.17,34.44 R17.1
N$14
  Bottom 0.406: R18.1 R17.2
N$15
  cutout Top: 30.48,11.43 12.7,11.43 12.7,8.89 30.48,8.89
  cutout Top: 49.53,11.43 34.29,11.43 34.29,8.89 49.53,8.89
  cutout Top: 63.5,11.43 53.34,11.43 53.34,8.89 63.5,8.89
N$16
  cutout Top: 8.89,36.83 11.43,36.83 11.43,31.75 8.89,31.75
N$17
  cutout Top: 24.13,59.69 59.69,59.69 59.69,49.53 24.13,49.53
ON/OFF_RS232
  Bottom 0.254: 40.8,23.5 36.67,23.5
  Bottom 0.305: 16.03,25.24 25.88,25.24 26.67,24.45
  Bottom 0.406: U1.11 41.27,23.97 40.8,23.5 | 36.67,23.5 27.62,23.5 26.67,24.45 | SW1.1 7.5,21.55 R2.2 7.62,20.32 7.94,20 12.38,20 13.34,20.95 13.34,24.13 14.45,25.24 16.03,25.24
ON/OFF_UART
  Bottom 0.305: U3.8 25.72,24.45 25.56,24.61 15.08,24.61 14.61,24.13
  Bottom 0.406: SW1.3 8.06,16.55 R4.2 8.26,16.67 8.26,18.41 8.89,19.05 13.34,19.05 14.61,20.32 14.61,23.5 14.61,24.13
PWM_MOTOCTL_ED
  Bottom 0.305: U3.2 19.37,26.19 19.68,25.88 26.67,25.88
  Bottom 0.406: 26.67,25.88 27.46,25.09 31.59,25.09 R18.2
RS232_RX_LH
  Bottom 0.406: U1.3 43.18,19.05 45.09,17.14 45.09,14.59 J3.3
RS232_TX_LH
  Bottom 0.406: U1.1 44.45,19.05 46.35,17.14 46.35,14.61 43.18,11.43 43.18,10.18 J3.4
UART_RX_ED
  Bottom 0.406: U1.16 44.45,26.19 46.04,27.78 46.04,32.94 | 46.04,32.94 46.04,34.92 48.26,37.15 48.26,43.66 50.32,45.72 56.2,45.72 57.15,46.67 57.15,54.77 55.94,55.98 JP1.J18_13 | R16.1 45.96,32.86 46.04,32.94
UART_RX_ED1
  Bottom 0.305: U3.3 20.64,26.67 20.8,26.51 27.78,26.51
  Bottom 0.406: 27.78,26.51 33.34,26.51 34.05,27.23 34.05,32.78 35.56,34.29 41.27,34.29 41.91,33.66 41.91,33.01 R16.2 | 41.68,32.38 R16.2 | 41.28,32.38 R16.2
UART_RX_LRP
  Bottom 0.406: U3.11 21.91,17.46 25.08,14.29 25.08,12.06 26.59,10.56 J1.6
UART_TX_ED
  Bottom 0.305: U3.4 21.91,27.3 22.07,27.15 26.67,27.15 27.15,27.62
  Bottom 0.406: U1.14 43.18,35.56 | 43.18,35.56 43.18,48.97 44.37,50.16 44.37,52.2 JP1.J19_8 | 27.15,27.62 28.89,27.62 29.84,28.57 29.84,32.38 30.48,33.02 33.02,33.02 35.56,35.56 43.18,35.56
UART_TX_LRP
  Bottom 0.406: U3.12 20.64,17.14 24.13,13.65 24.13,10.2 J1.5
V_BAT
  Bottom 0.406: D1.C 34.22,57.27 JP1.J18_5
VDD
  Bottom 0.406: U1.6 41.27,21.91 42.23,22.86 45.99,22.86 C4.1
VEE
  Bottom 0.406: U1.9 40.01,26.83 39.21,27.62 39.21,27.73 C5.1